# Altium schematic sheet basic_diagram.SchDoc
size A; SheetNumber: 2; SheetTotal: 2
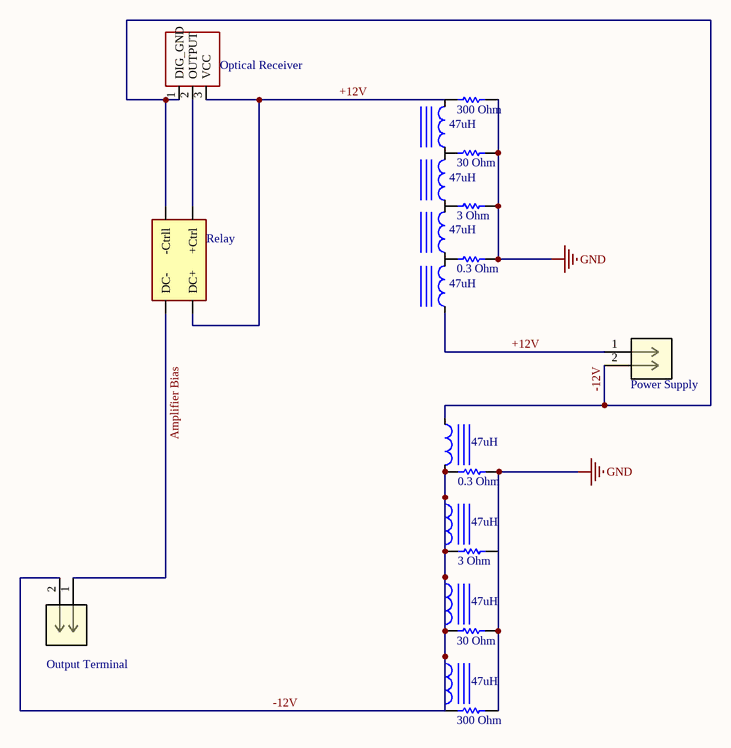
[diagram p0: basic_diagram.SchDoc]

## Parts
0.3_Ohm  ERJ-2BQJR30X  [03 Ohm]  (value not drawn)
0.3_Ohm  ERJ-2BQJR30X  [03 Ohm]  (value not drawn)
3_Ohm  ERJ-8GEYJ3R0V  [3 ohm]  (value not drawn)
3_Ohm  ERJ-8GEYJ3R0V  [3 ohm]  (value not drawn)
30_Ohm  ERJ1GNF30R0C  [30 Ohm]  (value not drawn)
30_Ohm  ERJ1GNF30R0C  [30 Ohm]  (value not drawn)
47uH  DR127-470-R  [47 uH]  (value not drawn)
47uH  DR127-470-R  [47 uH]  (value not drawn)
47uH  DR127-470-R  [47 uH]  (value not drawn)
47uH  DR127-470-R  [47 uH]  (value not drawn)
47uH  DR127-470-R  [47 uH]  (value not drawn)
47uH  DR127-470-R  [47 uH]  (value not drawn)
47uH  DR127-470-R  [47 uH]  (value not drawn)
47uH  DR127-470-R  [47 uH]  (value not drawn)
300_Ohm  ERA-2AEB301X  [300 Ohm]  (value not drawn)
300_Ohm  ERA-2AEB301X  [300 Ohm]  (value not drawn)
Optical_Receiver  IF-D95T  [IF-D95]  (value not drawn)
Output_Terminal  1054311102  [CONN_1054311102_MOL]  (value not drawn)
Power_Supply  1054311102  [CONN_1054311102_MOL]  (value not drawn)
Relay  Solid state relay  [CPC1002N]  (value not drawn)

## Nets
GND: 0.3_Ohm.1 0.3_Ohm.2 3_Ohm.2 30_Ohm.2 300_Ohm.2
+12V: 47uH.1 300_Ohm.1 Optical_Receiver.3(VCC) Power_Supply.1 Relay.4(DC+)
-12V: 47uH.1 300_Ohm.1 Optical_Receiver.1(DIG_GND) Output_Terminal.2 Power_Supply.2 Relay.2(-Ctrll)
Amplifier Bias: Output_Terminal.1 Relay.3(DC-)
Net0.3_Ohm_2: 0.3_Ohm.2 3_Ohm.1 47uH.1 47uH.2
Net47uH_1: 47uH.1 47uH.2
NetOptical_Receiver_2: Optical_Receiver.2(OUTPUT) Relay.1(+Ctrl)

Not connected (* = marked no-connect by the designer): 0.3_Ohm 1; 3_Ohm 1 2; 30_Ohm 1 1; 47uH 1 1 2 2 2

## Library data of the parts
0.3_Ohm 0.3_Ohm = ERJ-2BQJR30X: RES 0.3 OHM 5% 1/6W 0402; Manufacturer: Panasonic; Max Power Dissipation: 167mW; Temperature Coefficient: 250ppm/°C; Resistance: 300mR; Supplier 1: Digi-Key; Supplier Part Number 1: P17347CT-ND; Manufacturer Part Number: ERJ-2BQJR30X; RoHS: Yes; Category: Chip SMD Resistors; Stock 1: 18282; Pricing 1: 1=0.21000, 10=0.17600, 25=0.12800, 50=0.09280, 100=0.06880, 250=0.05280, 500=0.04160, 1000=0.02880, 5000=0.02400 (USD); Case/Package: 0402; Case Code (Imperial): 0402; Case Code (Metric): 1005; Min Operating Temperature: -55°C; Max Operating Temperature: 125°C; Features: Automotive AEC-Q200; Tolerance: 5%; Packaging: Tape and Reel; Resistor Type: Thick Film; Number of Terminations: 2; Length: 0.039inch; Width: 0.02inch; Height: 0.016inch; ComponentLink1URL: http://www.mouser.com/ds/2/315/AOA0000C295-1109214.pdf?src-supplier=Mouser; ComponentLink1Description: http://www.mouser.com/ds/2/315/AOA0000C295-1109214.pdf?src-supplier=Mouser; ComponentLink2URL: https://industrial.panasonic.com/cdbs/www-data/pdf/RDN0000/AOA0000C313.pdf?src-supplier=Digi-Key; ComponentLink2Description: https://industrial.panasonic.com/cdbs/www-data/pdf/RDN0000/AOA0000C313.pdf?src-supplier=Digi-Key
3_Ohm 3_Ohm = ERJ-8GEYJ3R0V: Res Thick Film 1206 3 Ohm 5% 1/4W -100ppm/C to 600ppm/C Molded SMD Punched Carrier T/R; Manufacturer: Panasonic; Resistance: 3R; Temperature Coefficient: 600ppm/°C; Power Rating: 250mW; Voltage Rating: 200V; Supplier 1: Digi-Key; Supplier Part Number 1: P3.0ECT-ND; Manufacturer Part Number: ERJ-8GEYJ3R0V; RoHS: Yes; Category: Chip SMD Resistors; Stock 1: 140112; Pricing 1: 1=0.10000, 10=0.05900, 100=0.02420, 1000=0.01087, 2500=0.00943 (USD); Mount: Surface Mount; Case/Package: 1206; Case Code (Metric): 3216; Case Code (Imperial): 1206; Contact Plating: Tin; Min Operating Temperature: -55°C; Max Operating Temperature: 155°C; Tolerance: 5%; Packaging: Tape and Reel; Resistor Type: Thick Film; Number of Terminations: 2; Max Power Dissipation: 250mW; Voltage Rating (DC): 200V; Package Quantity: 1; Features: Automotive AEC-Q200; Series: ERJ; Construction: Rectangular; Resistance Tolerance: 5%; Length: 3.2mm; Width: 0.063inch; Height: 0.028inch; Depth: 1.6mm; Radiation Hardening: No; Lead Free: Lead Free; RoHS Compliant: Yes; Military Standard: Not; REACH SVHC: No SVHC; ComponentLink1URL: https://datasheet.ciiva.com/30180/4aoa0000ce1-30180605.pdf?src-supplier=Onlinecomponents.com; ComponentLink1Description: https://datasheet.ciiva.com/30180/4aoa0000ce1-30180605.pdf?src-supplier=Onlinecomponents.com; ComponentLink2URL: https://datasheet.ciiva.com/17213/aoa0000ce1-17213823.pdf?src-supplier=Avnet+Europe; ComponentLink2Description: https://datasheet.ciiva.com/17213/aoa0000ce1-17213823.pdf?src-supplier=Avnet+Europe; ComponentLink3URL: https://datasheet.ciiva.com/46387/1500035-46387035.pdf?src-supplier=Element14; ComponentLink3Description: https://datasheet.ciiva.com/46387/1500035-46387035.pdf?src-supplier=Element14; ComponentLink4URL: https://datasheet.ciiva.com/46374/1500035-46374140.pdf?src-supplier=Element14; ComponentLink4Description: https://datasheet.ciiva.com/46374/1500035-46374140.pdf?src-supplier=Element14; ComponentLink5URL: https://datasheet.ciiva.com/9196/aoa0000ce1-9196703.pdf?src-supplier=Avnet; ComponentLink5Description: https://datasheet.ciiva.com/9196/aoa0000ce1-9196703.pdf?src-supplier=Avnet
30_Ohm 30_Ohm = ERJ1GNF30R0C: Thick Film Resistors 0201 30ohm 1% HalogenFree AEC-Q200; Manufacturer: Panasonic; Resistance: 30R; Power Rating: 50mW; Voltage Rating: 25V; Temperature Coefficient: 200ppm/°C; Supplier 1: Digi-Key; Supplier Part Number 1: P122923CT-ND; Manufacturer Part Number: ERJ1GNF30R0C; RoHS: Yes; Category: Chip SMD Resistors; Stock 1: 45233; Pricing 1: 1=0.10000, 10=0.04600, 100=0.01890, 1000=0.00848, 2500=0.00736, 5000=0.00608 (USD); Mount: Surface Mount; Case/Package: 0201; Number of Pins: 2; Case Code (Metric): 0603; Case Code (Imperial): 0201; Weight: 6E-06oz; Min Operating Temperature: -55°C; Max Operating Temperature: 125°C; Packaging: Tape and Reel; Tolerance: 1%; Package Quantity: 15000; Resistor Type: Thick Film; Number of Terminations: 2; Termination: SMD/SMT; Max Power Dissipation: 50mW; Voltage Rating (DC): 25V; Series: ERJ; Construction: Rectangular; Resistance Tolerance: 1%; Length: 0.6mm; Width: 0.012inch; Height: 0.01inch; Depth: 0.3mm; Radiation Hardening: No; Military Standard: Not; RoHS Compliant: Yes; REACH SVHC: Unknown; ComponentLink1URL: https://datasheet.ciiva.com/43467/1678782-43467017.pdf?src-supplier=Farnell; ComponentLink1Description: https://datasheet.ciiva.com/43467/1678782-43467017.pdf?src-supplier=Farnell; ComponentLink2URL: https://datasheet.ciiva.com/46373/1678782-46373500.pdf?src-supplier=Element14; ComponentLink2Description: https://datasheet.ciiva.com/46373/1678782-46373500.pdf?src-supplier=Element14; ComponentLink3URL: https://datasheet.ciiva.com/24128/aoa0000ce2-24128351.pdf?src-supplier=Mouser; ComponentLink3Description: https://datasheet.ciiva.com/24128/aoa0000ce2-24128351.pdf?src-supplier=Mouser
47uH 47uH 47uH 47uH 47uH 47uH 47uH 47uH = DR127-470-R: FIXED IND 47UH 2.95A 71.9 MOHM; Manufacturer: Eaton Cooper; Core Material: Ferrite; Tolerance: 20%; DC Resistance (DCR): 71.9mR; Max DC Current: 5.28A; Shielding: Shielded; Self Resonant Frequency: 100kHz; Inductor Type: POWER INDUCTOR; Supplier 1: Digi-Key; Supplier Part Number 1: 513-1050-1-ND; Manufacturer Part Number: DR127-470-R; RoHS: Yes; Category: Fixed Inductors; Stock 1: 351; Pricing 1: 1=1.36000, 10=1.26800, 25=1.17000, 50=0.97500, 100=0.91650 (USD); Mount: Surface Mount; Case/Package: Nonstandard; Number of Pins: 2; Weight: 0.208oz; Min Operating Temperature: -40°C; Max Operating Temperature: 125°C; Package Quantity: 350; Packaging: Tape and Reel; Inductance Tolerance: 20%; Inductance: 47uH; Termination: SMD/SMT; Current Rating: 2.95A; Test Frequency: 100kHz; RMS Current (Irms): 2.95A; Series: DR; Saturation Current: 5.28A; Resistor Type: Wirewound; Rated Current-Max: 2.95A; Length: 12.5mm; Width: 0.492inch; Height: 8mm; Depth: 12.5mm; Height - Seated (Max): 0.315inch; Radiation Hardening: No; REACH SVHC: No SVHC; RoHS Compliant: Yes; Lead Free: Lead Free; Military Standard: Not; ComponentLink1URL: https://datasheet.ciiva.com/14667/0900766b8116a153-14667792.pdf?src-supplier=RSComponents; ComponentLink1Description: https://datasheet.ciiva.com/14667/0900766b8116a153-14667792.pdf?src-supplier=RSComponents; ComponentLink2URL: https://datasheet.ciiva.com/26858/getdatasheetpartid-251127-26858422.pdf?src-supplier=Verical; ComponentLink2Description: https://datasheet.ciiva.com/26858/getdatasheetpartid-251127-26858422.pdf?src-supplier=Verical; ComponentLink3URL: https://datasheet.ciiva.com/16940/70037876-16940727.pdf?src-supplier=Allied+Electronics; ComponentLink3Description: https://datasheet.ciiva.com/16940/70037876-16940727.pdf?src-supplier=Allied+Electronics; ComponentLink4URL: https://datasheet.ciiva.com/30240/43bus-elx-ds-4315-dr-ser-30240985.pdf?src-supplier=Onlinecomponents.com; ComponentLink4Description: https://datasheet.ciiva.com/30240/43bus-elx-ds-4315-dr-ser-30240985.pdf?src-supplier=Onlinecomponents.com; ComponentLink5URL: https://datasheet.ciiva.com/8005/87246-8005180.pdf?src-supplier=Element14; ComponentLink5Description: https://datasheet.ciiva.com/8005/87246-8005180.pdf?src-supplier=Element14
300_Ohm 300_Ohm = ERA-2AEB301X: PANASONIC ELECTRONIC COMPONENTS         ERA2AEB301X            Surface Mount Chip Resistor, Metal Film, AEC-Q200 ERA Series, 300 ohm, 63 mW,  0.1%, 25 V; Resistance: 300R; Temperature Coefficient: 25ppm/°C; Power Rating: 63mW; Voltage Rating: 25V; Supplier 1: Digi-Key; Supplier Part Number 1: P300DCCT-ND; Manufacturer: Panasonic; Manufacturer Part Number: ERA-2AEB301X; RoHS: Yes; Category: Chip SMD Resistors; Stock 1: 16035; Pricing 1: 1=0.39000, 10=0.27800, 100=0.11110, 1000=0.05474, 2500=0.05072, 5000=0.04589 (USD); Mount: Surface Mount; Case/Package: 0402; Contact Plating: Tin; Case Code (Metric): 1005; Case Code (Imperial): 0402; Min Operating Temperature: -55°C; Max Operating Temperature: 155°C; Tolerance: 0.1%; Resistor Type: Metal Film; Packaging: Tape and Reel; Package Quantity: 1; Number of Terminations: 2; Termination: SMD/SMT; Max Power Dissipation: 63mW; Voltage Rating (DC): 25V; Features: Automotive AEC-Q200; Series: ERA-2A; Construction: Rectangular; Resistance Tolerance: 0.1%; Length: 1mm; Width: 0.02inch; Height: 0.016inch; Depth: 0.5mm; Radiation Hardening: No; REACH SVHC: No SVHC; Military Standard: Not; Lead Free: Lead Free; RoHS Compliant: Yes; ComponentLink1URL: https://datasheet.ciiva.com/17206/aoa0000ce26-17206360.pdf?src-supplier=Avnet+Europe; ComponentLink1Description: https://datasheet.ciiva.com/17206/aoa0000ce26-17206360.pdf?src-supplier=Avnet+Europe; ComponentLink2URL: https://datasheet.ciiva.com/30166/54aoa0000ce26-30166093.pdf?src-supplier=Onlinecomponents.com; ComponentLink2Description: https://datasheet.ciiva.com/30166/54aoa0000ce26-30166093.pdf?src-supplier=Onlinecomponents.com; ComponentLink3URL: https://datasheet.ciiva.com/9183/aoa0000ce26-9183279.pdf?src-supplier=Avnet; ComponentLink3Description: https://datasheet.ciiva.com/9183/aoa0000ce26-9183279.pdf?src-supplier=Avnet; ComponentLink4URL: https://datasheet.ciiva.com/43470/1776116-43470491.pdf?src-supplier=Farnell; ComponentLink4Description: https://datasheet.ciiva.com/43470/1776116-43470491.pdf?src-supplier=Farnell; ComponentLink5URL: https://datasheet.ciiva.com/46378/1776116-46378191.pdf?src-supplier=Element14; ComponentLink5Description: https://datasheet.ciiva.com/46378/1776116-46378191.pdf?src-supplier=Element14
Optical_Receiver = IF-D95T: DETECTOR PHOTOLOGIC TTL/CMOS; Manufacturer: Industrial Fiber Optics; Data Rate: 125Kbps; Operating Supply Current: 6mA; Rise Time: 70ns; Supplier 1: Digi-Key; Supplier Part Number 1: FB123-ND; Manufacturer Part Number: IF-D95T; RoHS: No; Category: Fiber Optic Cables; Package Quantity: 50; Lead Free: Contains Lead; ComponentLink1URL: https://datasheet.ciiva.com/2106/ifd95-2106550.pdf?src-supplier=Digi-Key; ComponentLink1Description: https://datasheet.ciiva.com/2106/ifd95-2106550.pdf?src-supplier=Digi-Key
Output_Terminal Power_Supply = 1054311102: Nano-Fit Vertical Header, Surface Mount, 2.50mm Pitch, Single Row, 2 Circuits, 0.76 u00B5m Tin (Sn) Plating, Black,...; Manufacturer: Molex; Supplier 1: Digi-Key; Supplier Part Number 1: WM26073CT-ND; Manufacturer Part Number: 1054311102; RoHS: No; Category: Connectors; Stock 1: 1192; Pricing 1: 1=2.05000, 10=1.85700, 100=1.59160 (USD)
Relay = CPC1002N